# Altium schematic sheet Connector_SFP.SchDoc: =SheetTitle_Top
size 420 x 297 mm; EDA_Number: ARTIQ; Author: G.Kasprowicz; CompanyName: WUT ISE; DrawnBy: G.Kasprowicz; Organization: WUT ISE; Address1: PW ISE; Address2: Nowowiejska 15/19 00-665 Warsaw; Address3: gkasprow@gmail.com; ModifiedBy: -; CheckedDate: -; Title2: Connector SFP+; DivGrp: WUT ISE; Designer: G.Kasprowicz; ModifiedDate: -; ProjectName: Sensor Box
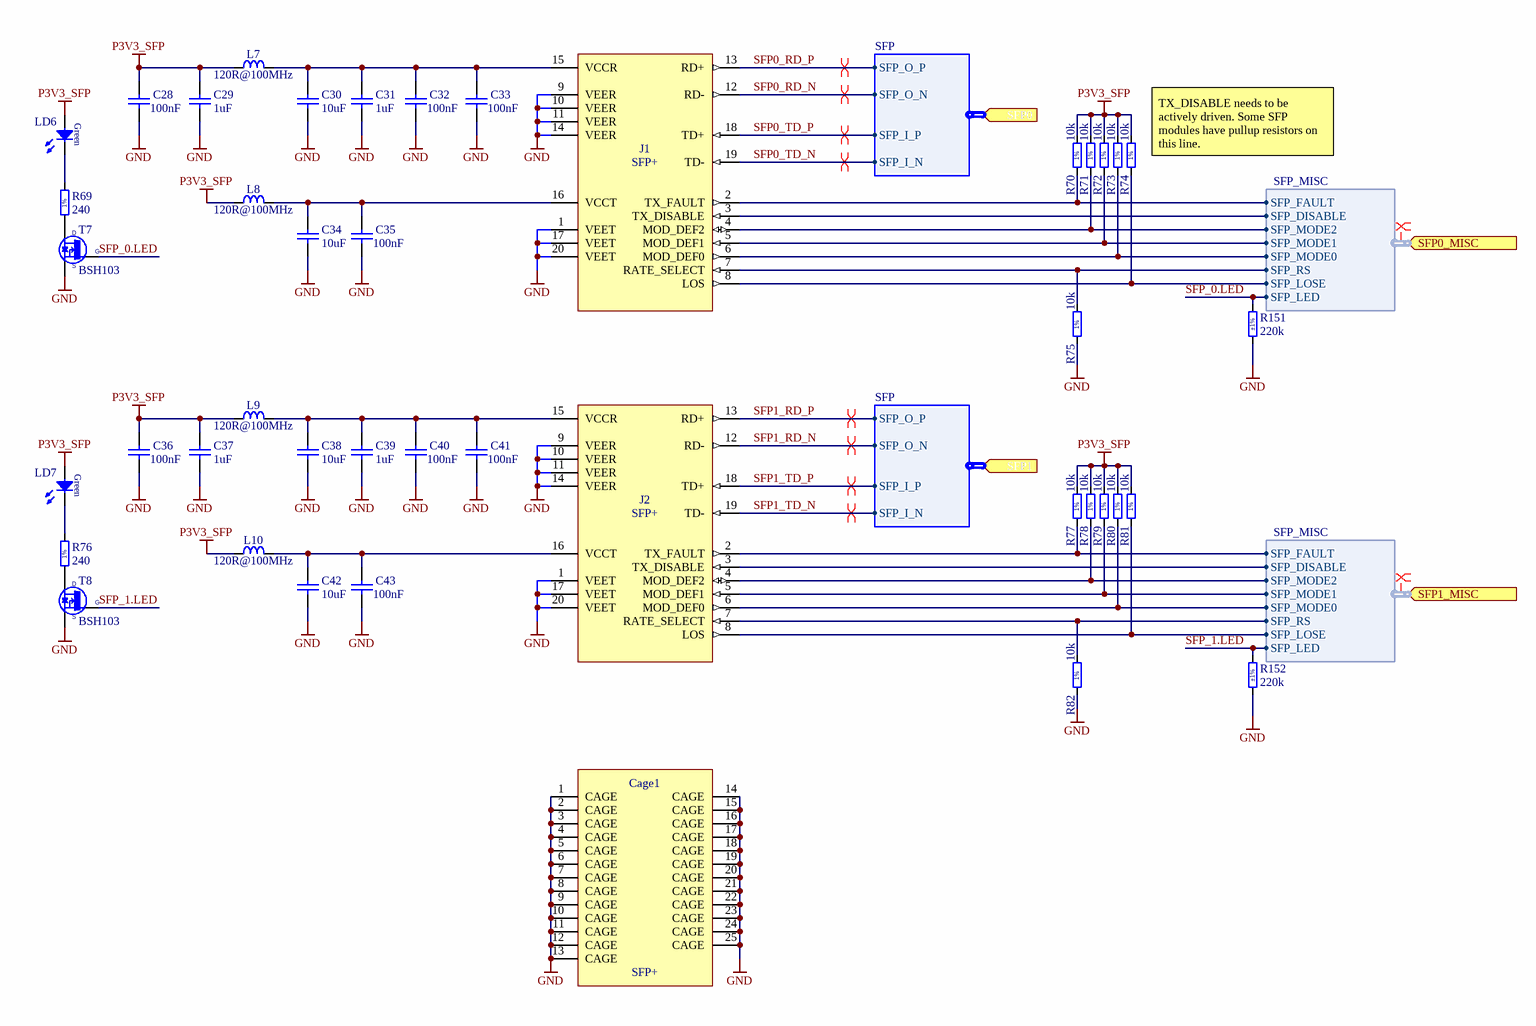
[diagram p0: Connector_SFP.SchDoc]

## Parts
C28  100nF  [CAPC1005X55N]
C29  1uF  [CAPC1005X55N]
C30  10uF  [CAPC1608X80N]
C31  1uF  [CAPC1005X55N]
C32  100nF  [CAPC1005X55N]
C33  100nF  [CAPC1005X55N]
C34  10uF  [CAPC1608X80N]
C35  100nF  [CAPC1005X55N]
C36  100nF  [CAPC1005X55N]
C37  1uF  [CAPC1005X55N]
C38  10uF  [CAPC1608X80N]
C39  1uF  [CAPC1005X55N]
C40  100nF  [CAPC1005X55N]
C41  100nF  [CAPC1005X55N]
C42  10uF  [CAPC1608X80N]
C43  100nF  [CAPC1005X55N]
Cage1  SFP+  [TYCO_2007263-1]
J1  SFP+  [MOLEX_74441-0001]
J2  SFP+  [MOLEX_74441-0001]
L7  120R@100MHz  [INDC1608X65N]
L8  120R@100MHz  [INDC1608X65N]
L9  120R@100MHz  [INDC1608X65N]
L10  120R@100MHz  [INDC1608X65N]
LD6  Green  [LED_AVAGO_HSME-C120]  (value not drawn)
LD7  Green  [LED_AVAGO_HSME-C120]  (value not drawn)
R69  240  [RESC1005X40N]
R70  10k  [RESC1005X40N]
R71  10k  [RESC1005X40N]
R72  10k  [RESC1005X40N]
R73  10k  [RESC1005X40N]
R74  10k  [RESC1005X40N]
R75  10k  [RESC1005X40N]
R76  240  [RESC1005X40N]
R77  10k  [RESC1005X40N]
R78  10k  [RESC1005X40N]
R79  10k  [RESC1005X40N]
R80  10k  [RESC1005X40N]
R81  10k  [RESC1005X40N]
R82  10k  [RESC1005X40N]
R151  220k  Tolerance: ±1%  [RESC1005X40N]
R152  220k  Tolerance: ±1%  [RESC1005X40N]
T7  BSH103  [SOT95P230X110-3N]
T8  BSH103  [SOT95P230X110-3N]

## Ports
SFP0 (in, harness SFP), SFP0_MISC (in, harness SFP_MISC), SFP1 (in, harness SFP), SFP1_MISC (in, harness SFP_MISC)

## Harnesses
SFP_MISC: SFP_FAULT, SFP_DISABLE, SFP_MODE2, SFP_MODE1, SFP_MODE0, SFP_RS, SFP_LOSE, SFP_LED
SFP: SFP_O_P, SFP_O_N, SFP_I_P, SFP_I_N

## Nets
GND: C28.1 C29.1 C30.1 C31.1 C32.1 C33.1 C34.1 C35.1 C36.1 C37.1 C38.1 C39.1 C40.1 C41.1 C42.1 C43.1 Cage1.1(CAGE) Cage1.2(CAGE) Cage1.3(CAGE) Cage1.4(CAGE) Cage1.5(CAGE) Cage1.6(CAGE) Cage1.7(CAGE) Cage1.8(CAGE) Cage1.9(CAGE) Cage1.10(CAGE) Cage1.11(CAGE) Cage1.12(CAGE) Cage1.13(CAGE) Cage1.14(CAGE) Cage1.15(CAGE) Cage1.16(CAGE) Cage1.17(CAGE) Cage1.18(CAGE) Cage1.19(CAGE) Cage1.20(CAGE) Cage1.21(CAGE) Cage1.22(CAGE) Cage1.23(CAGE) Cage1.24(CAGE) Cage1.25(CAGE) J1.1(VEET) J1.9(VEER) J1.10(VEER) J1.11(VEER) J1.14(VEER) J1.17(VEET) J1.20(VEET) J2.1(VEET) J2.9(VEER) J2.10(VEER) J2.11(VEER) J2.14(VEER) J2.17(VEET) J2.20(VEET) R75.1 R82.1 R151.1 R152.1 T7.2(S) T8.2(S)
P3V3_SFP: C28.2 C29.2 C36.2 C37.2 L7.1 L8.1 L9.1 L10.1 LD6.2(A) LD7.2(A) R70.2 R71.2 R72.2 R73.2 R74.2 R77.2 R78.2 R79.2 R80.2 R81.2
SFP0_RD_N: J1.12(RD-) ; port SFP0.SFP_O_N
SFP0_RD_P: J1.13(RD+) ; port SFP0.SFP_O_P
SFP0_TD_N: J1.19(TD-) ; port SFP0.SFP_I_N
SFP0_TD_P: J1.18(TD+) ; port SFP0.SFP_I_P
SFP1_RD_N: J2.12(RD-) ; port SFP1.SFP_O_N
SFP1_RD_P: J2.13(RD+) ; port SFP1.SFP_O_P
SFP1_TD_N: J2.19(TD-) ; port SFP1.SFP_I_N
SFP1_TD_P: J2.18(TD+) ; port SFP1.SFP_I_P
SFP_0.LED: R151.2 T7.1(G) ; port SFP0_MISC.SFP_LED
SFP_1.LED: R152.2 T8.1(G) ; port SFP1_MISC.SFP_LED
NetC30_2: C30.2 C31.2 C32.2 C33.2 J1.15(VCCR) L7.2
NetC34_2: C34.2 C35.2 J1.16(VCCT) L8.2
NetC38_2: C38.2 C39.2 C40.2 C41.2 J2.15(VCCR) L9.2
NetC42_2: C42.2 C43.2 J2.16(VCCT) L10.2
NetJ1_2: J1.2(TX_FAULT) R70.1 ; port SFP0_MISC.SFP_FAULT
NetJ1_3: J1.3(TX_DISABLE) ; port SFP0_MISC.SFP_DISABLE
NetJ1_4: J1.4(MOD_DEF2) R71.1 ; port SFP0_MISC.SFP_MODE2
NetJ1_5: J1.5(MOD_DEF1) R72.1 ; port SFP0_MISC.SFP_MODE1
NetJ1_6: J1.6(MOD_DEF0) R73.1 ; port SFP0_MISC.SFP_MODE0
NetJ1_7: J1.7(RATE_SELECT) R75.2 ; port SFP0_MISC.SFP_RS
NetJ1_8: J1.8(LOS) R74.1 ; port SFP0_MISC.SFP_LOSE
NetJ2_2: J2.2(TX_FAULT) R77.1 ; port SFP1_MISC.SFP_FAULT
NetJ2_3: J2.3(TX_DISABLE) ; port SFP1_MISC.SFP_DISABLE
NetJ2_4: J2.4(MOD_DEF2) R78.1 ; port SFP1_MISC.SFP_MODE2
NetJ2_5: J2.5(MOD_DEF1) R79.1 ; port SFP1_MISC.SFP_MODE1
NetJ2_6: J2.6(MOD_DEF0) R80.1 ; port SFP1_MISC.SFP_MODE0
NetJ2_7: J2.7(RATE_SELECT) R82.2 ; port SFP1_MISC.SFP_RS
NetJ2_8: J2.8(LOS) R81.1 ; port SFP1_MISC.SFP_LOSE
NetLD6_1: LD6.1(C) R69.2
NetLD7_1: LD7.1(C) R76.2
NetR69_1: R69.1 T7.3(D)
NetR76_1: R76.1 T8.3(D)

## Layout directives
differential pair; differential pair class Diff_100Ohm: SFP0_RD_N, SFP0_RD_P, SFP0_TD_N, SFP0_TD_P, SFP1_RD_N, SFP1_RD_P, SFP1_TD_N, SFP1_TD_P
net class SFP0: (no net found under the mark)
net class SFP1: (no net found under the mark)

## Notes on the sheet
- TX_DISABLE needs to be actively driven. Some SFP modules have pullup resistors on this line.
- Project/Equipment
- Document
- Designer
- Drawn by
- Check.by
- Copyright WUT ISE 2020.
  This documentation describes Open Hardware and is licensed under the CERN OHL v.1.2. You may redistribute and modify this documentation under the terms of the CERN OHL v.1.2. (http://ohwr.org/CERNOHL). This documentation is distributed WITHOUT ANY EXPRESS OR IMPLIED WARRANTY, INCLUDING OF MERCHANTABILITY, SATISFACTORY QUALITY AND FITNESS FOR A PARTICULAR PURPOSE. Please see the CERN OHL v.1.2 for applicable conditions.
- Contact
- File
- Last Mod.
- Print Date
- Sheet
- Size
- A3
- of
- Rev
- (in symbol R0402_10K_1%_0.0625W_100PPM) 1%
- (in symbol R0402_240R_1%_0.0625W_100PPM) 1%

## Library data of the parts
C28 C32 C33 C35 C36 C40 C41 C43 = CC0402_100NF_16V_10%_X5R: Non-polarised capacitor; Part Description: SMD Multilayer Chip Ceramic Capacitor; Manufacturer: GENERIC; Manufacturer1 Part Number: GRM155R61C104KA88D; Voltage: 16V; TC: X5R; Tolerance: ±10%; Part Number: CC0402_100NF_16V_10%_X5R; Component Kind: Standard; Component Type: Standard; Pin Count: 2; Value: 100nF; Status: None; Manufacturer Part Number: CC0402_100NF_16V_10%_X5R; Case: 0402; Mounted: Yes; Socket: No; SMD: Yes; Sense: No; Manufacturer1 Example: MURATA; Manufacturer1 ComponentHeight: 0.55mm; HelpURL: \\cern.ch\dfs\Applications\Altium\Datasheets\CC0402_X5R_MURATA_GRM.pdf; Author: CERN DEM JLC; CreateDate: 10.12.2013; LatestRevisionDate: 10.12.2013
C29 C31 C37 C39 = CC0402_1UF_16V_10%_X5R: Non-polarised capacitor; Part Description: SMD Multilayer Chip Ceramic Capacitor; Manufacturer: GENERIC; Manufacturer1 Part Number: C1005X5R1C105KT; Voltage: 16V; TC: X5R; Tolerance: ±10%; Part Number: CC0402_1UF_16V_10%_X5R; Component Kind: Standard; Component Type: Standard; Pin Count: 2; Value: 1uF; Status: Preferred; Manufacturer Part Number: CC0402_1UF_16V_10%_X5R; Case: 0402; Mounted: Yes; Socket: No; SMD: Yes; Sense: No; Manufacturer1 Example: TDK; Manufacturer1 ComponentHeight: 0.55mm; HelpURL: \\cern.ch\dfs\Applications\Altium\Datasheets\CC0402_X5R_TDK_C.pdf; Author: CERN DEM JLC; CreateDate: 2012-10-25; LatestRevisionDate: 2012-10-25
C30 C34 C38 C42 = CC0603_10UF_16V_20%_X5R: Non-polarised capacitor; Part Description: SMD Multilayer Chip Ceramic Capacitor; Manufacturer: GENERIC; Manufacturer1 Part Number: GRM188R61C106MA73D; Voltage: 16V; TC: X5R; Tolerance: ±20%; Part Number: CC0603_10UF_16V_20%_X5R; Component Kind: Standard; Component Type: Standard; Pin Count: 2; Value: 10uF; Status: None; Manufacturer Part Number: CC0603_10UF_16V_20%_X5R; Case: 0603; Mounted: Yes; Socket: No; SMD: Yes; Sense: No; Manufacturer1 Example: MURATA; Manufacturer1 ComponentHeight: 0.8mm; HelpURL: \\cern.ch\dfs\Applications\Altium\Datasheets\CC0603_X5R_MURATA_GRM.pdf; Author: CERN DEM MR; CreateDate: 02.03.2016; LatestRevisionDate: 02.03.2016
Cage1 = TYCO_2007263-1: SFP 1x2 Cage (25Pins); Part Description: 1x2 Press Fit SFP+ Cage with EMI Springs; Manufacturer: TYCO ELECTRONICS; Part Number: TYCO_2007263-1; Component Kind: Standard; Component Type: Standard; Pin Count: 25; Family: SFP+; Mounted: Yes; Socket: No; SMD: No; PressFit: Yes; Sense: No; Status: None; Manufacturer Part Number: 2007263-1; ComponentHeight: 9.7mm; HelpURL: \\cern.ch\dfs\Applications\Altium\Datasheets\TYCO_2007263-1.pdf; Author: CERN DEM JLC; CreateDate: 18.01.2017; LatestRevisionDate: 18.01.2017
J1 J2 = MOLEX_74441-0001: 20 Position SFP  Connector (Small Form-factor Pluggable); Part Description: 20 Position, Pitch 0.8mm SFP Receptacle (Small Form-factor Pluggable); Manufacturer: MOLEX; PressFit: No; Part Number: MOLEX_74441-0001; Component Kind: Standard; Component Type: Standard; Pin Count: 20; Family: SFP+; Mounted: Yes; Socket: No; SMD: Yes; Sense: No; Status: None; Manufacturer Part Number: 74441-0001; ComponentHeight: 5.4mm; HelpURL: \\cern.ch\dfs\Applications\Altium\Datasheets\MOLEX_74441-0001.pdf; ComponentLink1URL: \\cern.ch\dfs\Applications\Altium\Datasheets\MOLEX_SFP_Application.pdf; ComponentLink1Description: Application; Author: CERN DEM MR; CreateDate: 03.12.2015; LatestRevisionDate: 03.12.2015
L7-L10 = IND0603_MURATA_BLM18SG121TN1D: Inductor; Part Description: SMD EMIFIL Suppression Chip Ferrite Bead; Manufacturer: MURATA; Power: 3A; Resistance: 0.025R; Tolerance: ±25%; Part Number: IND0603_MURATA_BLM18SG121TN1D; Component Kind: Standard; Component Type: Standard; Pin Count: 2; Value: 120R@100MHz; Status: None; Manufacturer Part Number: BLM18SG121TN1D; Case: 0603; Mounted: Yes; Socket: No; SMD: Yes; Sense: No; ComponentHeight: 0.65mm; HelpURL: \\cern.ch\dfs\Applications\Altium\Datasheets\IND0603_MURATA_BLM18S.pdf; Author: CERN DEM JLC; CreateDate: 23.07.2014; LatestRevisionDate: 23.07.2014
LD6 LD7 = LED_AVAGO_HSME-C120: LED Green 1C 2A; Part Description: High Performance Right Angle Chip Green LED; Manufacturer: AVAGO TECHNOLOGIES; PressFit: No; Bonding: No; Part Number: LED_AVAGO_HSME-C120; Component Kind: Standard; Component Type: Standard; Color: Green; PackageDescription: Green Chip LED, 2-Leads, Body 1.7x1.1mm, Side Emitting Package; Manufacturer Part Number: HSME-C120; Pin Count: 2; Mounted: Yes; Socket: No; SMD: Yes; Sense: No; ComponentHeight: 0.7mm; HelpURL: \\cern.ch\dfs\Applications\Altium\Datasheets\LED_AVAGO_HSME-C120.pdf; ComponentLink1URL: \\cern.ch\dfs\Applications\Altium\Datasheets\LED_AVAGO_HSME-C110_DESIGN-GUIDE.pdf; ComponentLink1Description: Design Guide; Author: CERN DEM JMW; CreateDate: 22.07.2009; LatestRevisionDate: 20.06.2012
R69 R76 = R0402_240R_1%_0.0625W_100PPM: Resistor - 1%; Part Description: General Purpose Thick Film Chip Resistor; Manufacturer: GENERIC; Manufacturer1 Part Number: 232270672401L; TC: ±100ppm/°C; PressFit: No; Part Number: R0402_240R_1%_0.0625W_100PPM; Component Kind: Standard; Component Type: Standard; Pin Count: 2; Value: 240; Status: Not Recommended; Power: 0.0625W; Tolerance: ±1%; Manufacturer Part Number: R0402_240R_1%_0.0625W_100PPM; Case: 0402; Mounted: Yes; Sense: No; Socket: No; SMD: Yes; Manufacturer1 Example: YAGEO PHYCOMP; Manufacturer1 ComponentHeight: 0.4mm; HelpURL: \\cern.ch\dfs\Applications\Altium\Datasheets\R0402_Phycomp_RC0402.pdf; Author: CERN DEM JLC; CreateDate: 03.12.2007; LatestRevisionDate: 17.10.2012
R70-R75 R77-R82 = R0402_10K_1%_0.0625W_100PPM: Resistor - 1%; Part Description: General Purpose Thick Film Chip Resistor; Manufacturer: GENERIC; Manufacturer1 Part Number: 232270671003L; TC: ±100ppm/°C; PressFit: No; Part Number: R0402_10K_1%_0.0625W_100PPM; Component Kind: Standard; Component Type: Standard; Pin Count: 2; Value: 10k; Status: Not Recommended; Power: 0.0625W; Tolerance: ±1%; Manufacturer Part Number: R0402_10K_1%_0.0625W_100PPM; Case: 0402; Mounted: Yes; Sense: No; Socket: No; SMD: Yes; Manufacturer1 Example: YAGEO PHYCOMP; Manufacturer1 ComponentHeight: 0.4mm; HelpURL: \\cern.ch\dfs\Applications\Altium\Datasheets\R0402_Phycomp_RC0402.pdf; Author: CERN DEM JLC; CreateDate: 03.12.2007; LatestRevisionDate: 17.10.2012
R151 R152 = R0402_220K_1%_0.0625W_100PPM: Resistor - 1%; Part Description: General Purpose Thick Film Chip Resistor; Manufacturer: GENERIC; Manufacturer1 Part Number: 232270672204L; TC: ±100ppm/°C; PressFit: No; Part Number: R0402_220K_1%_0.0625W_100PPM; Component Kind: Standard; Component Type: Standard; Pin Count: 2; Value: 220k; Status: Not Recommended; Power: 0.0625W; Manufacturer Part Number: R0402_220K_1%_0.0625W_100PPM; Case: 0402; Mounted: Yes; Sense: No; Socket: No; SMD: Yes; Manufacturer1 Example: YAGEO PHYCOMP; Manufacturer1 ComponentHeight: 0.4mm; HelpURL: \\cern.ch\dfs\Applications\Altium\Datasheets\R0402_Phycomp_RC0402.pdf; Author: CERN DEM JLC; CreateDate: 03.12.2007; LatestRevisionDate: 17.10.2012
T7 T8 = BSH103: N-CHANNEL MOSFET WITH DIODE; Part Description: 30V 850mA N-Channel Enhancement Mode Field-Effect Transistor; Manufacturer: NEXPERIA; PressFit: No; Bonding: No; Part Number: BSH103; Component Kind: Standard; Component Type: Standard; Device: BSH103; PackageDescription: SOT23, 3 pin, Pitch 0.95mm - 1.3mm W X 2.9mm L X 1.1mm H, IPC Medium Density; Manufacturer Part Number: BSH103; Pin Count: 3; Case: SOT23-3; Mounted: Yes; Socket: No; SMD: Yes; Sense: No; ComponentHeight: 1.1mm; HelpURL: \\cern.ch\dfs\Applications\Altium\Datasheets\BSH103.pdf; Author: CERN DEM JLC; CreateDate: 16.03.2010; LatestRevisionDate: 20.06.2017